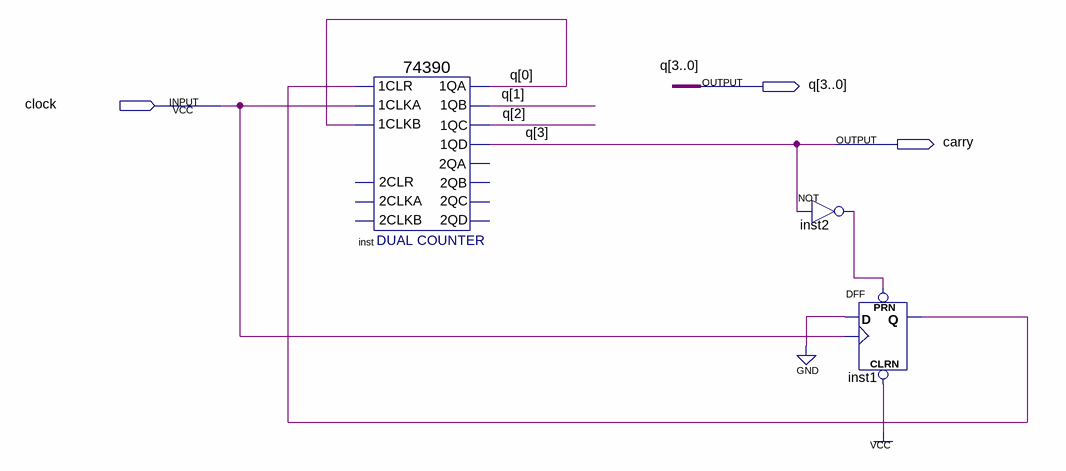
[diagram p0: schematic sheet]
// Quartus schematic cnt8_display.bdf as structural Verilog: 3 symbols, 3 pins
module cnt8_display (
  input  clock,
  output [3:0] q,
  output carry
);

  wire inst1_q, inst2_out;

  \74390  inst (
    .\1CLR (inst1_q), .\1CLKA (clock), .\1CLKB (q[0]), .\1QA (q[0]), .\1QB (q[1]), .\1QC (q[2]), .\1QD (carry));  // open: 2CLKA, 2CLR, 2CLKB, 2QA, 2QB, 2QC, 2QD
  not inst2 (inst2_out, carry);
  DFF inst1 (.CLRN(1'b1), .CLK(clock), .D(1'b0), .PRN(inst2_out), .Q(inst1_q));

  assign q[3] = carry;
endmodule
